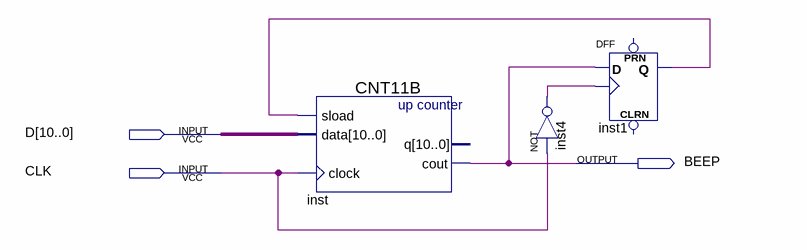
[diagram p0: schematic sheet]
// Quartus schematic SPK0.bdf as structural Verilog: 3 symbols, 3 pins
module SPK0 (
  input  [10:0] D,
  input  CLK,
  output BEEP
);

  wire inst1_q, inst4_out;

  CNT11B inst (.sload(inst1_q), .data(D), .clock(CLK), .cout(BEEP));  // open: q
  not inst4 (inst4_out, CLK);
  DFF inst1 (.CLK(inst4_out), .D(BEEP), .Q(inst1_q));  // open: CLRN, PRN
endmodule
